# Altium schematic sheet PDU_Schematic.SchDoc
size 431 x 279 mm; SheetNumber: 1; SheetTotal: 2
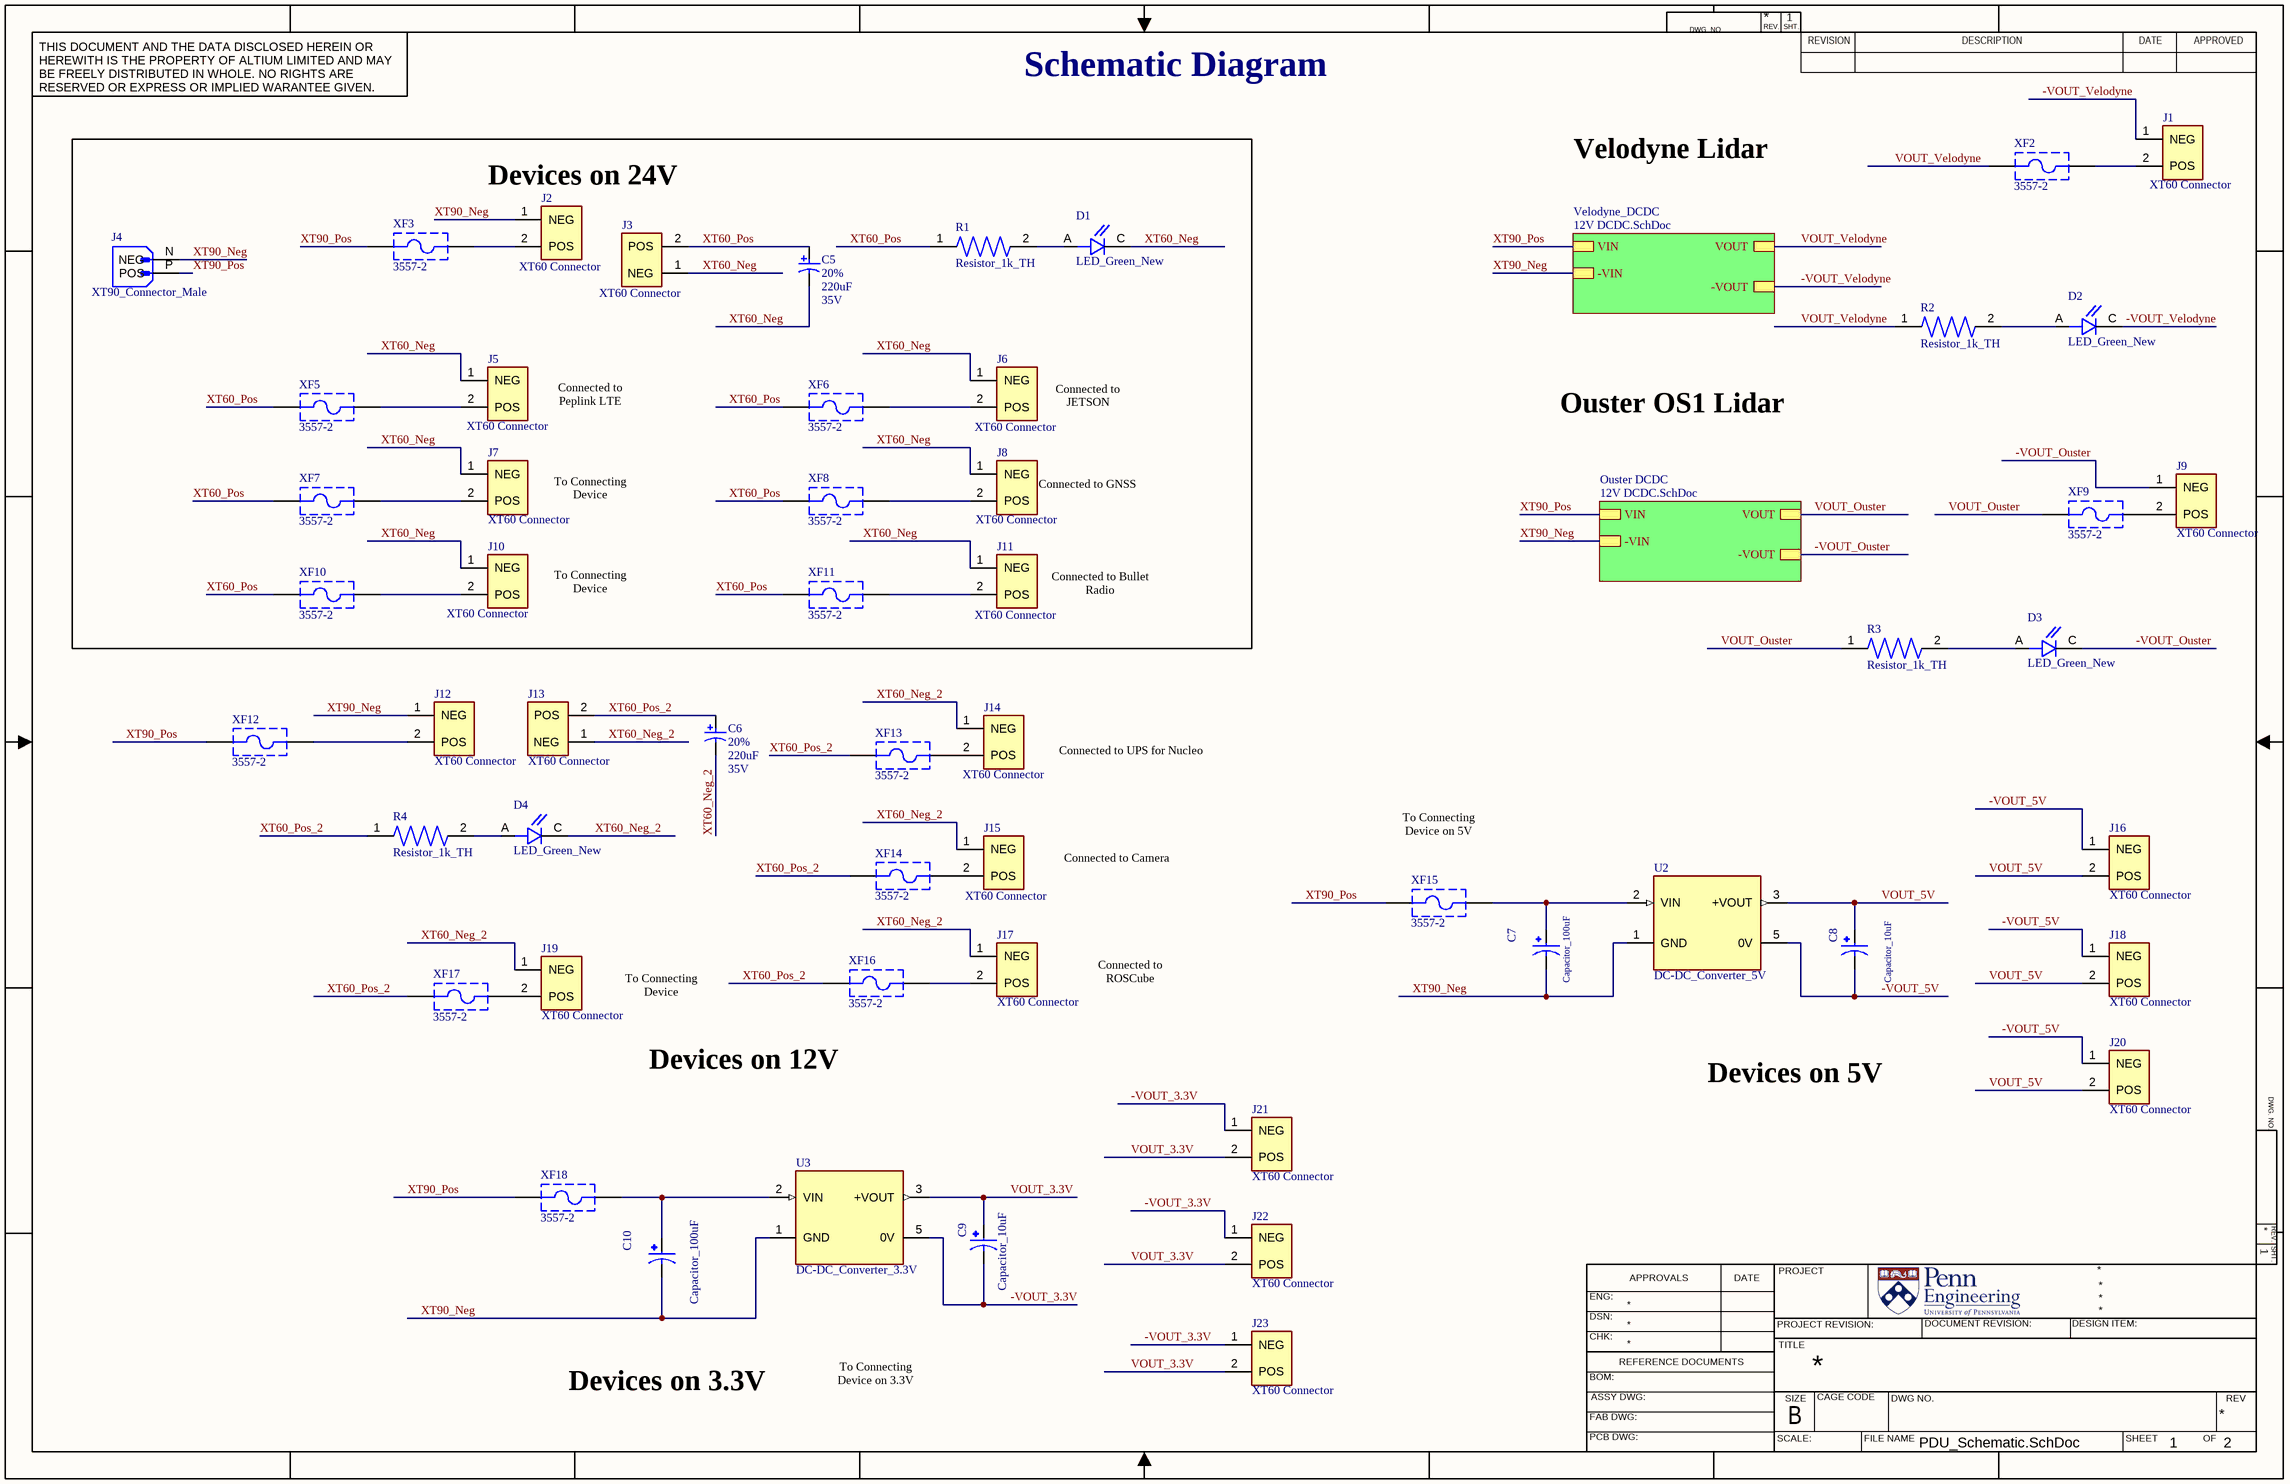
[diagram p0: PDU_Schematic.SchDoc]

## Parts
C5  value 220uF  Tolerance: 20%  Voltage: 35V  [NicCap_10x12.5]  (hidden comment: ESC227M035AH1AA)
C6  value 220uF  Tolerance: 20%  Voltage: 35V  [NicCap_10x12.5]  (hidden comment: ESC227M035AH1AA)
C7  Capacitor_100uF  [Capacitor_100uF]
C8  Capacitor_10uF  [Capacitor_10uF]
C9  Capacitor_10uF  [Capacitor_10uF]
C10  Capacitor_100uF  [Capacitor_100uF]
D1  LED_Green_New  [LED_Green_New]
D2  LED_Green_New  [LED_Green_New]
D3  LED_Green_New  [LED_Green_New]
D4  LED_Green_New  [LED_Green_New]
J1  XT60 Connector  [XT60_Connector]
J2  XT60 Connector  [XT60_Connector]
J3  XT60 Connector  [XT60_Connector]
J4  XT90_Connector_Male  [XT90_Connector_Male]
J5  XT60 Connector  [XT60_Connector]
J6  XT60 Connector  [XT60_Connector]
J7  XT60 Connector  [XT60_Connector]
J8  XT60 Connector  [XT60_Connector]
J9  XT60 Connector  [XT60_Connector]
J10  XT60 Connector  [XT60_Connector]
J11  XT60 Connector  [XT60_Connector]
J12  XT60 Connector  [XT60_Connector]
J13  XT60 Connector  [XT60_Connector]
J14  XT60 Connector  [XT60_Connector]
J15  XT60 Connector  [XT60_Connector]
J16  XT60 Connector  [XT60_Connector]
J17  XT60 Connector  [XT60_Connector]
J18  XT60 Connector  [XT60_Connector]
J19  XT60 Connector  [XT60_Connector]
J20  XT60 Connector  [XT60_Connector]
J21  XT60 Connector  [XT60_Connector]
J22  XT60 Connector  [XT60_Connector]
J23  XT60 Connector  [XT60_Connector]
R1  Resistor_1k_TH  [Resistor_1k_TH]
R2  Resistor_1k_TH  [Resistor_1k_TH]
R3  Resistor_1k_TH  [Resistor_1k_TH]
R4  Resistor_1k_TH  [Resistor_1k_TH]
U2  DC-DC_Converter_5V  [DC-DC_Converter_5V]
U3  DC-DC_Converter_3.3V  [DC-DC_Converter_3.3V]
XF2  3557-2  [KSTN-3557-2]
XF3  3557-2  [KSTN-3557-2]
XF5  3557-2  [KSTN-3557-2]
XF6  3557-2  [KSTN-3557-2]
XF7  3557-2  [KSTN-3557-2]
XF8  3557-2  [KSTN-3557-2]
XF9  3557-2  [KSTN-3557-2]
XF10  3557-2  [KSTN-3557-2]
XF11  3557-2  [KSTN-3557-2]
XF12  3557-2  [KSTN-3557-2]
XF13  3557-2  [KSTN-3557-2]
XF14  3557-2  [KSTN-3557-2]
XF15  3557-2  [KSTN-3557-2]
XF16  3557-2  [KSTN-3557-2]
XF17  3557-2  [KSTN-3557-2]
XF18  3557-2  [KSTN-3557-2]

## Blocks framed on the sheet
Devices on 24V: C5 D1 J2-J8 J10 J11 R1 XF3 XF5-XF8 XF10 XF11

## Sub-sheets
Ouster DCDC = 12V DCDC.SchDoc: VIN, VOUT, -VIN, -VOUT
Velodyne_DCDC = 12V DCDC.SchDoc: VIN, VOUT, -VIN, -VOUT

## Nets
-VOUT_3.3V: C9.N J21.1(NEG) J22.1(NEG) J23.1(NEG) U3.5(0V)
-VOUT_5V: C8.N J16.1(NEG) J18.1(NEG) J20.1(NEG) U2.5(0V)
-VOUT_Ouster: D3.C J9.1(NEG) ; sheet Ouster DCDC/-VOUT
-VOUT_Velodyne: D2.C J1.1(NEG) ; sheet Velodyne_DCDC/-VOUT
VOUT_3.3V: C9.P J21.2(POS) J22.2(POS) J23.2(POS) U3.3(+VOUT)
VOUT_5V: C8.P J16.2(POS) J18.2(POS) J20.2(POS) U2.3(+VOUT)
VOUT_Ouster: R3.1 XF9.1 ; sheet Ouster DCDC/VOUT
VOUT_Velodyne: R2.1 XF2.1 ; sheet Velodyne_DCDC/VOUT
XT60_Neg: C5.2 D1.C J3.1(NEG) J5.1(NEG) J6.1(NEG) J7.1(NEG) J8.1(NEG) J10.1(NEG) J11.1(NEG)
XT60_Neg_2: C6.2 D4.C J13.1(NEG) J14.1(NEG) J15.1(NEG) J17.1(NEG) J19.1(NEG)
XT60_Pos: C5.1 J3.2(POS) R1.1 XF5.1 XF6.1 XF7.1 XF8.1 XF10.1 XF11.1
XT60_Pos_2: C6.1 J13.2(POS) R4.1 XF13.1 XF14.1 XF16.1 XF17.1
XT90_Neg: C7.N C10.N J2.1(NEG) J4.N(NEG) J12.1(NEG) U2.1(GND) U3.1(GND) ; sheet Velodyne_DCDC/-VIN, sheet Ouster DCDC/-VIN
XT90_Pos: J4.P(POS) XF3.1 XF12.1 XF15.1 XF18.1 ; sheet Velodyne_DCDC/VIN, sheet Ouster DCDC/VIN
NetC7_P: C7.P U2.2(VIN) XF15.2
NetC10_P: C10.P U3.2(VIN) XF18.2
NetD1_A: D1.A R1.2
NetD2_A: D2.A R2.2
NetD3_A: D3.A R3.2
NetD4_A: D4.A R4.2
NetJ1_2: J1.2(POS) XF2.2
NetJ2_2: J2.2(POS) XF3.2
NetJ5_2: J5.2(POS) XF5.2
NetJ6_2: J6.2(POS) XF6.2
NetJ7_2: J7.2(POS) XF7.2
NetJ8_2: J8.2(POS) XF8.2
NetJ9_2: J9.2(POS) XF9.2
NetJ10_2: J10.2(POS) XF10.2
NetJ11_2: J11.2(POS) XF11.2
NetJ12_2: J12.2(POS) XF12.2
NetJ14_2: J14.2(POS) XF13.2
NetJ15_2: J15.2(POS) XF14.2
NetJ17_2: J17.2(POS) XF16.2
NetJ19_2: J19.2(POS) XF17.2

## Notes on the sheet
- Schematic Diagram
- Velodyne Lidar
- Connected to Peplink LTE
- (near J6) Connected to JETSON
- Ouster OS1 Lidar
- To Connecting Device
- (near J8) Connected to GNSS
- Connected to Bullet Radio
- Connected to UPS for Nucleo
- To Connecting Device on 5V
- Connected to Camera
- Connected to ROSCube
- Devices on 12V
- Devices on 5V
- Devices on 3.3V
- To Connecting Device on 3.3V
- DWG. NO.
- REV.
- SHT.
- THIS DOCUMENT AND THE DATA DISCLOSED HEREIN OR HEREWITH IS THE PROPERTY OF ALTIUM LIMITED AND MAY BE FREELY DISTRIBUTED IN WHOLE. NO RIGHTS ARE RESERVED OR EXPRESS OR IMPLIED WARANTEE GIVEN.
- REVISION
- DESCRIPTION
- DATE
- APPROVED
- ENG:
- APPROVALS
- PROJECT
- DSN:
- CHK:
- REFERENCE DOCUMENTS
- PROJECT REVISION:
- TITLE
- DOCUMENT REVISION:
- DESIGN ITEM:
- BOM:
- FAB DWG:
- PCB DWG:
- ASSY DWG:
- SCALE:
- SIZE
- B
- CAGE CODE
- FILE NAME
- DWG NO.
- SHEET
- OF
- REV

## Library data of the parts
C5 C6 = CMP-3131333-1: Aluminum Electrolytic Capacitor, Polarized, Aluminum (wet), 35V, 20% +Tol, 20% -Tol, 220uF, Through Hole Mount; Manufacturer Series: ESC; Dielectric Material: Aluminium; Tan Delta: 0.1; Ripple Current: 560mA; Leakage Current: 77uA; Polarity: Polarized; Mount: Through Hole; Max Operating Temperature: 105°C; Length: 12mm; RoHS Compliant: Yes; Number of Pins: 2; Package Shape: Cylindrical; Min Operating Temperature: -40°C; Package Style: RadialMeter; Capacitor Type: Aluminium; Diameter: 10mm; Packaging: Bulk; Series: ESC; Terminal Pitch: 5mm; REACH SVHC: Yes; Termination: Wire
C7 C10 = Capacitor_100uF: Cap Aluminum Lytic 100uF 16V 20% (5 X 11mm) Radial 5mm 180mA 2000h 85C Automotive Ammo; Manufacturer: Panasonic; Manufacturer Part Number: ECA-1CM101B; Life (Hours): 2000Hour; Leakage Current: 3mA; Dissipation Factor: 0.2%; Lead/Base Style: Straight; Lead Diameter: 0.5mm; Supplier 1: Arrow Electronics; Supplier Part Number 1: ECA-1CM101B; RoHS: Yes; Category: Aluminum Electrolytic Capacitors; Stock 1: 3761; Pricing 1: 1=0.28870, 10=0.18780, 25=0.18590, 100=0.09900, 250=0.09800, 500=0.05120, 1000=0.04920, 3000=0.04870 (USD); Mount: Through Hole,PCB; Case/Package: Radial; Min Operating Temperature: -40°C; Max Operating Temperature: 85°C; Packaging: Ammo Pack; Package Quantity: 2000; Series: M; Capacitance: 100uF; Voltage Rating: 16V; Tolerance: 20%; Ripple Current: 180mA; Voltage Rating (DC): 16V; Termination: Radial; Voltage: 16V; Construction: RADIAL; Diameter: 5mm; Length: 11mm; Width: 0inch; Height: 11mm; Lead Pitch: 5mm; Height - Seated (Max): 0.472inch; Radiation Hardening: No; REACH SVHC: Unknown; Lead Free: Lead Free; RoHS Compliant: Yes; ComponentLink1URL: https://datasheet.ciiva.com/7803/aba0000ce12-7803672.pdf?src-supplier=Element14; ComponentLink1Description: https://datasheet.ciiva.com/7803/aba0000ce12-7803672.pdf?src-supplier=Element14; ComponentLink2URL: https://datasheet.ciiva.com/14608/70067785-14608475.pdf?src-supplier=Allied+Electronics; ComponentLink2Description: https://datasheet.ciiva.com/14608/70067785-14608475.pdf?src-supplier=Allied+Electronics
C8 C9 = Capacitor_10uF: Cap Aluminum 10uF 50V 20% (6.3 X 5mm) Radial 2.5mm 35mA 1000 hr 85°C Bulk; Manufacturer: Panasonic; Manufacturer Part Number: ECE-A1HKS100; Polarity: Polar; Life (Hours): 1000Hour; Leakage Current: 3A; Lead Diameter: 0.45mm; Supplier 1: Arrow Electronics; Supplier Part Number 1: ECE-A1HKS100; RoHS: Yes; Category: Aluminum Electrolytic Capacitors; Stock 1: 3775; Pricing 1: 1=0.34520, 10=0.24180, 50=0.15970, 100=0.13540, 500=0.07970, 1000=0.07890, 2500=0.07540, 5000=0.07350 (USD); Mount: Through Hole,PCB; Case/Package: Radial; Number of Pins: 2; Weight: 0.01lb; Min Operating Temperature: -40°C; Max Operating Temperature: 85°C; Capacitance: 10uF; Packaging: Bulk; Ripple Current: 35mA; Tolerance: 20%; Voltage Rating: 50V; Package Quantity: 200; Voltage Rating (DC): 50V; Termination: Radial; Voltage: 50V; Series: KS; Construction: RADIAL; Ripple Current (AC): 35mA; Diameter: 6.3mm; Length: 5mm; Width: 0.5inch; Height: 5mm; Lead Pitch: 2.5mm; Height - Seated (Max): 0.197inch; Radiation Hardening: No; RoHS Compliant: Yes; REACH SVHC: No SVHC; Lead Free: Lead Free; ComponentLink1URL: https://datasheet.ciiva.com/11778/0900766b800274c4-11778985.pdf?src-supplier=RSComponents; ComponentLink1Description: https://datasheet.ciiva.com/11778/0900766b800274c4-11778985.pdf?src-supplier=RSComponents; ComponentLink2URL: https://datasheet.ciiva.com/2983/aba0000ce15-2983886.pdf?src-supplier=Avnet; ComponentLink2Description: https://datasheet.ciiva.com/2983/aba0000ce15-2983886.pdf?src-supplier=Avnet; ComponentLink3URL: https://datasheet.ciiva.com/43459/1339471-43459545.pdf?src-supplier=Farnell; ComponentLink3Description: https://datasheet.ciiva.com/43459/1339471-43459545.pdf?src-supplier=Farnell; ComponentLink4URL: https://datasheet.ciiva.com/24025/a-e-461514-24025641.pdf?src-supplier=Mouser; ComponentLink4Description: https://datasheet.ciiva.com/24025/a-e-461514-24025641.pdf?src-supplier=Mouser; ComponentLink5URL: https://datasheet.ciiva.com/16205/aba0000ce15-16205737.pdf?src-supplier=Future+Electronics; ComponentLink5Description: https://datasheet.ciiva.com/16205/aba0000ce15-16205737.pdf?src-supplier=Future+Electronics; ComponentLink6URL: https://datasheet.ciiva.com/46397/1339471-46397117.pdf?src-supplier=Element14; ComponentLink6Description: https://datasheet.ciiva.com/46397/1339471-46397117.pdf?src-supplier=Element14; ComponentLink7URL: https://datasheet.ciiva.com/15166/getdatasheetpartid-169217-15166123.pdf?src-supplier=Verical; ComponentLink7Description: https://datasheet.ciiva.com/15166/getdatasheetpartid-169217-15166123.pdf?src-supplier=Verical; ComponentLink8URL: https://datasheet.ciiva.com/14594/70067878-14594328.pdf?src-supplier=Allied+Electronics; ComponentLink8Description: https://datasheet.ciiva.com/14594/70067878-14594328.pdf?src-supplier=Allied+Electronics
D1-D4 = LED_Green_New: White high-intensity LED lamp, Color White, Vf 3.2 V, Radial-2, RoHS; Manufacturer: TT Optek; Manufacturer Part Number: OVLAW4CB7; Lens Color: Colorless; Lens Style: Dome,Clear,Round; Luminous Intensity: 6200mcd; Forward Voltage: 3.2V; Viewing Angle: 45°; Forward Current: 20mA; Lens Transparency: Clear; Lead Length: 26.6mm; Supplier 1: Arrow Electronics; Supplier Part Number 1: OVLAW4CB7; RoHS: Yes; Category: LEDs; Stock 1: 9; Pricing 1: 1=0.42860 (USD); Mount: Through Hole; Case/Package: Radial; Number of Pins: 1; Color: White; Min Operating Temperature: -40°C; Max Operating Temperature: 100°C; Package Quantity: 500; Packaging: Bulk; Illumination Color: White; Test Current: 20mA; Series: -; Height: 5.2mm; Lead Free: Lead Free; RoHS Compliant: Yes; REACH SVHC: No SVHC; ComponentLink1URL: https://datasheet.ciiva.com/2113/ovlaw4cb7-2113528.pdf?src-supplier=Digi-Key; ComponentLink1Description: https://datasheet.ciiva.com/2113/ovlaw4cb7-2113528.pdf?src-supplier=Digi-Key; ComponentLink2URL: https://datasheet.ciiva.com/13500/ovlaw4cb7-20369-13500840.pdf?src-supplier=Mouser; ComponentLink2Description: https://datasheet.ciiva.com/13500/ovlaw4cb7-20369-13500840.pdf?src-supplier=Mouser
J1-J3 J5-J23 = XT60 Connector: DC power connectors AMASS - XT60
J4 = XT90_Connector_Male: DC power connectors AMASS - XT90
R1-R4 = Resistor_1k_TH: Carbon Film Resistors - Through Hole 1K Ohm 5% 1/4W Res Carbon Film; Manufacturer: TE Connectivity; Manufacturer Part Number: 2-1623927-3; Power Rating: 250mW; Resistance: 1kR; Temperature Coefficient: -450ppm/°C; Supplier 1: Arrow Electronics; Supplier Part Number 1: CFR16J1K0; RoHS: Yes; Category: Through-Hole Resistors; Stock 1: 3327; Pricing 1: 1=0.06670, 10=0.05530, 25=0.03960, 50=0.03920, 100=0.02970, 250=0.02310, 500=0.01850, 1000=0.01310, 3000=0.01300 (USD); Mount: Through Hole; Case/Package: Conformal; Min Operating Temperature: -55°C; Max Operating Temperature: 155°C; Tolerance: 5%; Packaging: Cut Tape; Resistor Type: Carbon Film; Termination: Axial; Number of Terminations: 2; Series: CFR16, Neohm; Max Power Dissipation: 250mW; Package Quantity: 1; Construction: Cylindrical; Diameter: 1.85mm; Length: 3.5mm; Radiation Hardening: No; RoHS Compliant: Yes; Military Standard: Not; ComponentLink1URL: https://datasheet.ciiva.com/5477/ng-ds-1773195-c-207356-5477538.pdf?src-supplier=Mouser; ComponentLink1Description: https://datasheet.ciiva.com/5477/ng-ds-1773195-c-207356-5477538.pdf?src-supplier=Mouser; ComponentLink2URL: https://datasheet.ciiva.com/6533/eng-cd-1623927-ba-6533055.pdf?src-supplier=Digi-Key; ComponentLink2Description: https://datasheet.ciiva.com/6533/eng-cd-1623927-ba-6533055.pdf?src-supplier=Digi-Key; ComponentLink3URL: https://datasheet.ciiva.com/30240/eng-ds-1773195-e-30240795.pdf?src-supplier=Onlinecomponents.com; ComponentLink3Description: https://datasheet.ciiva.com/30240/eng-ds-1773195-e-30240795.pdf?src-supplier=Onlinecomponents.com
U2 = DC-DC_Converter_5V: 5 Vdc, 2 A, 10 W, 8 to 36 Vdc Input Range; Manufacturer: CUI; Manufacturer Part Number: P7805-2000R-S; Supplier 1: DigiKey; Supplier Part Number 1: 102-P7805-2000R-S-ND; Stock 1: 17; Pricing 1: 1=5.96000, 5=5.87200, 10=5.78600, 25=5.61600, 44=5.44591, 88=5.27568, 264=5.10557, 440=4.76518 (USD); ComponentLink1URL: https://datasheet.octopart.com/P7805-2000R-S-CUI-datasheet-165372030.pdf?src-supplier=CUI; ComponentLink1Description: https://datasheet.octopart.com/P7805-2000R-S-CUI-datasheet-165372030.pdf?src-supplier=CUI; ComponentLink2URL: https://datasheet.octopart.com/P7805-2000R-S-CUI-datasheet-165270846.pdf?src-supplier=Electro+Sonic; ComponentLink2Description: https://datasheet.octopart.com/P7805-2000R-S-CUI-datasheet-165270846.pdf?src-supplier=Electro+Sonic
U3 = DC-DC_Converter_3.3V: 3.3 Vdc, 2 A, 6.6 W, 6 to 36 Vdc Input Range; Manufacturer: CUI; Manufacturer Part Number: P7803-2000R-S; Supplier 1: Digi-Key; Supplier Part Number 1: 102-P7803-2000R-S-ND; Stock 1: 88; Pricing 1: 1=5.96000, 5=5.87200, 10=5.78600, 25=5.61600, 44=5.44591, 88=5.27568, 264=5.10557, 440=4.76518 (USD); ComponentLink1URL: https://datasheet.octopart.com/P7803-2000R-S-CUI-datasheet-165372030.pdf?src-supplier=CUI; ComponentLink1Description: https://datasheet.octopart.com/P7803-2000R-S-CUI-datasheet-165372030.pdf?src-supplier=CUI; ComponentLink2URL: https://datasheet.octopart.com/P7803-2000R-S-CUI-datasheet-165270846.pdf?src-supplier=Electro+Sonic; ComponentLink2Description: https://datasheet.octopart.com/P7803-2000R-S-CUI-datasheet-165270846.pdf?src-supplier=Electro+Sonic
XF2 = CMP-000024-2: Fuse Holder; Auto; 2 in1 Blade; THM; 1 Fuse; Vertical; 30 Amps; ATO/ATC; FuseCurrent: 2A; FNet: VELODYNE; FuseVoltage: 32VDC
XF3 = CMP-000024-2: Fuse Holder; Auto; 2 in1 Blade; THM; 1 Fuse; Vertical; 30 Amps; ATO/ATC; FuseCurrent: 5A; FNet: 24VDC; FuseVoltage: 32VDC
XF5 = CMP-000024-2: Fuse Holder; Auto; 2 in1 Blade; THM; 1 Fuse; Vertical; 30 Amps; ATO/ATC; FuseCurrent: 1A; FNet: PEPLINK; FuseVoltage: 32VDC
XF6 = CMP-000024-2: Fuse Holder; Auto; 2 in1 Blade; THM; 1 Fuse; Vertical; 30 Amps; ATO/ATC; FuseCurrent: 3A; FNet: JETSON; FuseVoltage: 32VDC
XF7 XF10 XF17 = CMP-000024-2: Fuse Holder; Auto; 2 in1 Blade; THM; 1 Fuse; Vertical; 30 Amps; ATO/ATC; FuseCurrent: XX; FNet: SPARE; FuseVoltage: 32VDC
XF8 = CMP-000024-2: Fuse Holder; Auto; 2 in1 Blade; THM; 1 Fuse; Vertical; 30 Amps; ATO/ATC; FuseCurrent: 0.5A; FNet: GNSS; FuseVoltage: 32VDC
XF9 = CMP-000024-2: Fuse Holder; Auto; 2 in1 Blade; THM; 1 Fuse; Vertical; 30 Amps; ATO/ATC; FuseCurrent: 2A; FNet: OUSTER; FuseVoltage: 32VDC
XF11 = CMP-000024-2: Fuse Holder; Auto; 2 in1 Blade; THM; 1 Fuse; Vertical; 30 Amps; ATO/ATC; FuseCurrent: 0.5A; FNet: POE; FuseVoltage: 32VDC
XF12 = CMP-000024-2: Fuse Holder; Auto; 2 in1 Blade; THM; 1 Fuse; Vertical; 30 Amps; ATO/ATC; FuseCurrent: 3A; FNet: 12VDC; FuseVoltage: 32VDC
XF13 = CMP-000024-2: Fuse Holder; Auto; 2 in1 Blade; THM; 1 Fuse; Vertical; 30 Amps; ATO/ATC; FuseCurrent: 0.5A; FNet: PCM; FuseVoltage: 32VDC
XF14 = CMP-000024-2: Fuse Holder; Auto; 2 in1 Blade; THM; 1 Fuse; Vertical; 30 Amps; ATO/ATC; FuseCurrent: 0.5A; FNet: CAMERA; FuseVoltage: 32VDC
XF15 XF16 XF18 = CMP-000024-2: Fuse Holder; Auto; 2 in1 Blade; THM; 1 Fuse; Vertical; 30 Amps; ATO/ATC